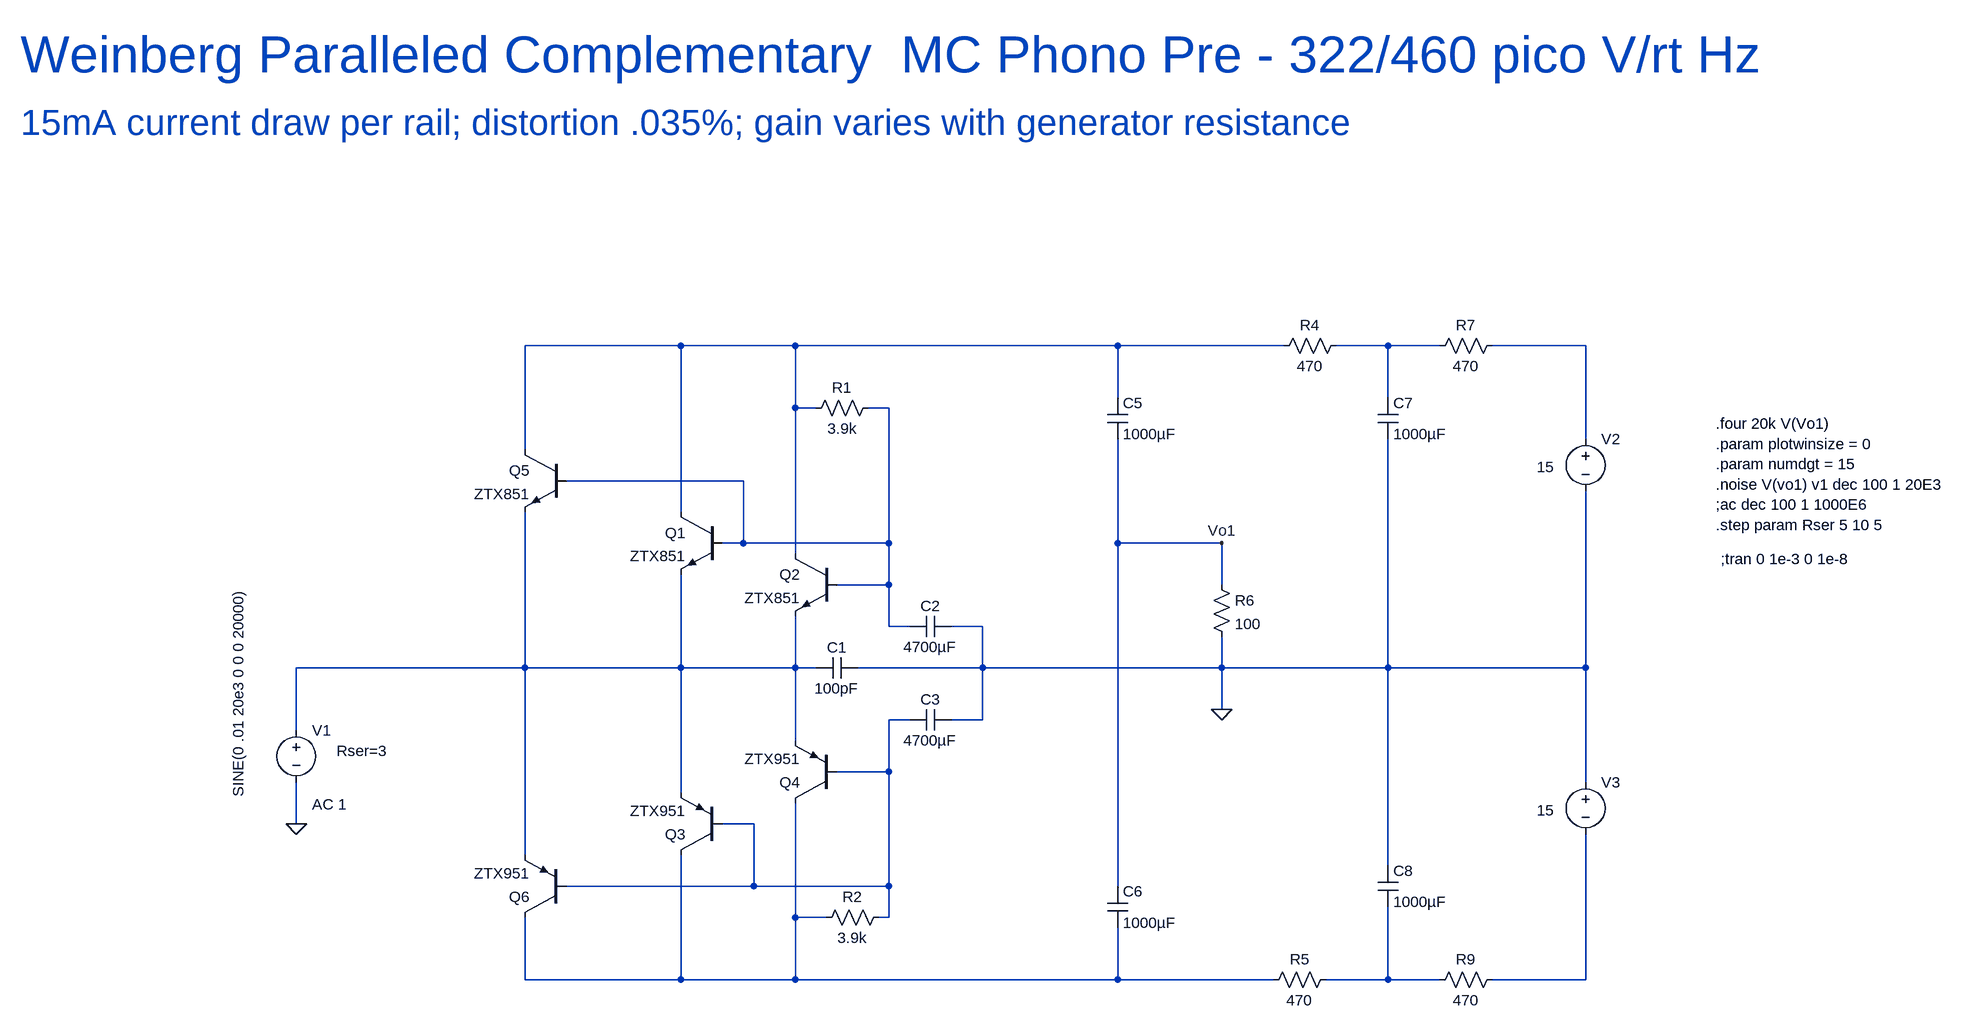
[diagram p0: schematic Weinberg.asc]
Weinberg.asc, the LTspice schematic file:
Version 4
SHEET 1 2776 680
WIRE 240 -368 0 -368
WIRE 416 -368 240 -368
WIRE 912 -368 416 -368
WIRE 1168 -368 912 -368
WIRE 1328 -368 1248 -368
WIRE 1408 -368 1328 -368
WIRE 1632 -368 1488 -368
WIRE 912 -288 912 -368
WIRE 1328 -288 1328 -368
WIRE 416 -272 416 -368
WIRE 448 -272 416 -272
WIRE 560 -272 528 -272
WIRE 1632 -224 1632 -368
WIRE 0 -208 0 -368
WIRE 336 -160 64 -160
WIRE 240 -112 240 -368
WIRE 336 -64 336 -160
WIRE 336 -64 304 -64
WIRE 560 -64 560 -272
WIRE 560 -64 336 -64
WIRE 912 -64 912 -224
WIRE 1072 -64 912 -64
WIRE 416 -48 416 -272
WIRE 560 0 560 -64
WIRE 560 0 480 0
WIRE 1072 0 1072 -64
WIRE 560 64 560 0
WIRE 592 64 560 64
WIRE 704 64 656 64
WIRE 0 128 0 -112
WIRE 0 128 -352 128
WIRE 240 128 240 -16
WIRE 240 128 0 128
WIRE 416 128 416 48
WIRE 416 128 240 128
WIRE 448 128 416 128
WIRE 704 128 704 64
WIRE 704 128 512 128
WIRE 1072 128 1072 80
WIRE 1072 128 704 128
WIRE 1328 128 1328 -224
WIRE 1328 128 1072 128
WIRE 1632 128 1632 -144
WIRE 1632 128 1328 128
WIRE 1072 192 1072 128
WIRE 592 208 560 208
WIRE 704 208 704 128
WIRE 704 208 656 208
WIRE -352 224 -352 128
WIRE 416 240 416 128
WIRE 560 288 560 208
WIRE 560 288 480 288
WIRE 1632 304 1632 128
WIRE 240 320 240 128
WIRE -352 368 -352 304
WIRE 352 368 304 368
WIRE 0 416 0 128
WIRE 1328 432 1328 128
WIRE 352 464 352 368
WIRE 352 464 64 464
WIRE 560 464 560 288
WIRE 560 464 352 464
WIRE 912 464 912 -64
WIRE 416 512 416 336
WIRE 464 512 416 512
WIRE 560 512 560 464
WIRE 560 512 544 512
WIRE 0 608 0 512
WIRE 240 608 240 416
WIRE 240 608 0 608
WIRE 416 608 416 512
WIRE 416 608 240 608
WIRE 912 608 912 528
WIRE 912 608 416 608
WIRE 1152 608 912 608
WIRE 1328 608 1328 496
WIRE 1328 608 1232 608
WIRE 1408 608 1328 608
WIRE 1632 608 1632 384
WIRE 1632 608 1488 608
FLAG -352 368 0
FLAG 1072 192 0
FLAG 1072 -64 Vo1
SYMBOL voltage -352 208 R0
WINDOW 3 -89 -203 VRight 2
WINDOW 123 24 130 Left 2
WINDOW 39 62 48 Left 2
SYMATTR Value SINE(0 .01 20e3 0 0 0 20000)
SYMATTR Value2 AC 1
SYMATTR SpiceLine Rser=3
SYMATTR InstName V1
SYMBOL voltage 1632 -240 R0
WINDOW 3 -75 59 Left 2
WINDOW 123 24 130 Left 2
WINDOW 39 0 0 Left 2
SYMATTR Value 15
SYMATTR InstName V2
SYMBOL npn 480 -48 M0
SYMATTR InstName Q2
SYMATTR Value ZTX851
SYMBOL pnp 480 336 R180
SYMATTR InstName Q4
SYMATTR Value ZTX951
SYMBOL res 432 -256 R270
WINDOW 0 32 56 VTop 2
WINDOW 3 0 56 VBottom 2
SYMATTR InstName R1
SYMATTR Value 3.9k
SYMBOL res 560 496 R90
WINDOW 0 0 56 VBottom 2
WINDOW 3 32 56 VTop 2
SYMATTR InstName R2
SYMATTR Value 3.9k
SYMBOL cap 656 48 R90
WINDOW 0 0 32 VBottom 2
WINDOW 3 32 32 VTop 2
SYMATTR InstName C2
SYMATTR Value 4700µF
SYMBOL cap 656 192 R90
WINDOW 0 0 32 VBottom 2
WINDOW 3 32 32 VTop 2
SYMATTR InstName C3
SYMATTR Value 4700µF
SYMBOL res 1264 -384 R90
WINDOW 0 0 56 VBottom 2
WINDOW 3 32 56 VTop 2
SYMATTR InstName R4
SYMATTR Value 470
SYMBOL res 1248 592 R90
WINDOW 0 0 56 VBottom 2
WINDOW 3 32 56 VTop 2
SYMATTR InstName R5
SYMATTR Value 470
SYMBOL cap 896 -288 R0
SYMATTR InstName C5
SYMATTR Value 1000µF
SYMBOL cap 896 464 R0
SYMATTR InstName C6
SYMATTR Value 1000µF
SYMBOL res 1056 -16 R0
SYMATTR InstName R6
SYMATTR Value 100
SYMBOL res 1504 -384 R90
WINDOW 0 0 56 VBottom 2
WINDOW 3 32 56 VTop 2
SYMATTR InstName R7
SYMATTR Value 470
SYMBOL res 1504 592 R90
WINDOW 0 0 56 VBottom 2
WINDOW 3 32 56 VTop 2
SYMATTR InstName R9
SYMATTR Value 470
SYMBOL cap 1312 -288 R0
SYMATTR InstName C7
SYMATTR Value 1000µF
SYMBOL cap 1312 432 R0
SYMATTR InstName C8
SYMATTR Value 1000µF
SYMBOL voltage 1632 288 R0
WINDOW 3 -75 59 Left 2
WINDOW 123 24 130 Left 2
WINDOW 39 0 0 Left 2
SYMATTR Value 15
SYMATTR InstName V3
SYMBOL cap 512 112 R90
WINDOW 0 0 32 VBottom 2
WINDOW 3 32 32 VTop 2
SYMATTR InstName C1
SYMATTR Value 100pF
SYMBOL npn 304 -112 M0
SYMATTR InstName Q1
SYMATTR Value ZTX851
SYMBOL pnp 304 416 R180
SYMATTR InstName Q3
SYMATTR Value ZTX951
SYMBOL npn 64 -208 M0
SYMATTR InstName Q5
SYMATTR Value ZTX851
SYMBOL pnp 64 512 R180
SYMATTR InstName Q6
SYMATTR Value ZTX951
TEXT 1840 -40 Left 2 !;tran 0 1e-3 0 1e-8
TEXT 1832 -248 Left 2 !.four 20k V(Vo1)\n.param plotwinsize = 0\n.param numdgt = 15\n.noise V(vo1) v1 dec 100 1 20E3\n;ac dec 100 1 1000E6\n.step param Rser 5 10 5
TEXT -776 -816 Left 6 ;Weinberg Paralleled Complementary  MC Phono Pre - 322/460 pico V/rt Hz
TEXT -776 -712 Left 5 ;15mA current draw per rail; distortion .035%; gain varies with generator resistance

The netlist it stands for:
* Weinberg.asc
V1 N005 0 SINE(0 .01 20e3 0 0 0 20000) AC 1 Rser=3
V2 N003 0 15
Q2 N001 N004 N005 0 ZTX851
Q4 N007 N006 N005 0 ZTX951
R1 N001 N004 3.9k
R2 N006 N007 3.9k
C2 0 N004 4700µF
C3 0 N006 4700µF
R4 N002 N001 470
R5 N008 N007 470
C5 N001 Vo1 1000µF
C6 Vo1 N007 1000µF
R6 Vo1 0 100
R7 N003 N002 470
R9 N009 N008 470
C7 N002 0 1000µF
C8 0 N008 1000µF
V3 0 N009 15
C1 0 N005 100pF
Q1 N001 N004 N005 0 ZTX851
Q3 N007 N006 N005 0 ZTX951
Q5 N001 N004 N005 0 ZTX851
Q6 N007 N006 N005 0 ZTX951
.model NPN NPN
.model PNP PNP
.lib standard.bjt
;tran 0 1e-3 0 1e-8
.four 20k V(Vo1)
.param plotwinsize = 0
.param numdgt = 15
.noise V(vo1) v1 dec 100 1 20E3
;ac dec 100 1 1000E6
.step param Rser 5 10 5
* Weinberg Paralleled Complementary  MC Phono Pre - 322/460 pico V/rt Hz
* 15mA current draw per rail; distortion .035%; gain varies with generator resistance
.backanno
.end